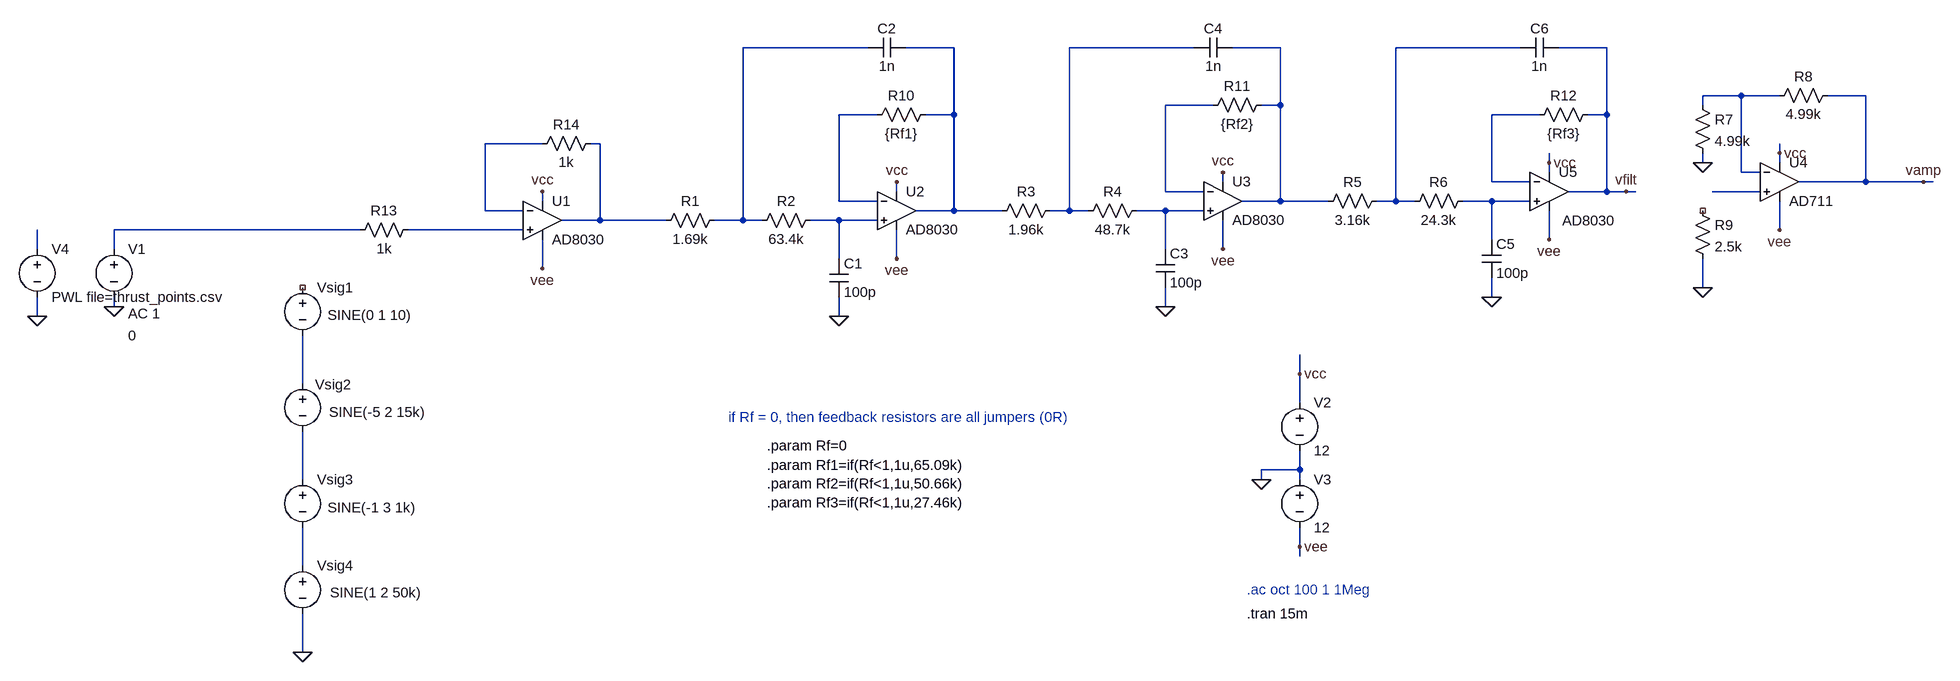
[diagram p0: schematic Anti-Aliasing Filter 30kHz 6th order Bessel - AD8030.asc]
Anti-Aliasing Filter 30kHz 6th order Bessel - AD8030.asc, the LTspice schematic file:
Version 4
SHEET 1 2352 744
WIRE 528 -304 320 -304
WIRE 672 -304 592 -304
WIRE 1072 -304 864 -304
WIRE 1216 -304 1136 -304
WIRE 1616 -304 1408 -304
WIRE 1760 -304 1680 -304
WIRE 1984 -224 1920 -224
WIRE 2048 -224 1984 -224
WIRE 2192 -224 2128 -224
WIRE 1104 -208 1024 -208
WIRE 1216 -208 1216 -304
WIRE 1216 -208 1184 -208
WIRE 1920 -208 1920 -224
WIRE 544 -192 480 -192
WIRE 672 -192 672 -304
WIRE 672 -192 624 -192
WIRE 1648 -192 1568 -192
WIRE 1760 -192 1760 -304
WIRE 1760 -192 1728 -192
WIRE -16 -144 -112 -144
WIRE 80 -144 64 -144
WIRE 2048 -128 2048 -144
WIRE 1664 -112 1664 -128
WIRE 1920 -112 1920 -128
WIRE 2048 -112 2048 -128
WIRE 1664 -96 1664 -112
WIRE 1984 -96 1984 -224
WIRE 2016 -96 1984 -96
WIRE 1120 -80 1120 -96
WIRE 1568 -80 1568 -192
WIRE 1632 -80 1568 -80
WIRE 2192 -80 2192 -224
WIRE 2192 -80 2080 -80
WIRE 2288 -80 2192 -80
WIRE 2304 -80 2288 -80
WIRE 576 -64 576 -80
WIRE 1024 -64 1024 -208
WIRE 1088 -64 1024 -64
WIRE 1760 -64 1760 -192
WIRE 1760 -64 1696 -64
WIRE 1792 -64 1760 -64
WIRE 1808 -64 1792 -64
WIRE 2016 -64 1936 -64
WIRE -16 -48 -16 -64
WIRE 480 -48 480 -192
WIRE 544 -48 480 -48
WIRE 1216 -48 1216 -208
WIRE 1216 -48 1152 -48
WIRE 1296 -48 1216 -48
WIRE 1408 -48 1408 -304
WIRE 1408 -48 1376 -48
WIRE 1440 -48 1408 -48
WIRE 1568 -48 1520 -48
WIRE 1632 -48 1568 -48
WIRE -112 -32 -112 -144
WIRE -48 -32 -112 -32
WIRE 672 -32 672 -192
WIRE 672 -32 608 -32
WIRE 752 -32 672 -32
WIRE 864 -32 864 -304
WIRE 864 -32 832 -32
WIRE 896 -32 864 -32
WIRE 1024 -32 976 -32
WIRE 1088 -32 1024 -32
WIRE 80 -16 80 -144
WIRE 80 -16 16 -16
WIRE 192 -16 80 -16
WIRE 320 -16 320 -304
WIRE 320 -16 272 -16
WIRE 352 -16 320 -16
WIRE 480 -16 432 -16
WIRE 544 -16 480 -16
WIRE -320 0 -832 0
WIRE -48 0 -240 0
WIRE 2048 0 2048 -48
WIRE 1568 16 1568 -48
WIRE 1664 16 1664 -32
WIRE -960 32 -960 0
WIRE -832 32 -832 0
WIRE 1024 32 1024 -32
WIRE 1120 32 1120 -16
WIRE 480 48 480 -16
WIRE 576 48 576 0
WIRE -16 64 -16 16
WIRE 1920 96 1920 48
WIRE 1568 112 1568 80
WIRE -832 128 -832 112
WIRE 1024 128 1024 96
WIRE -960 144 -960 112
WIRE 480 144 480 112
WIRE 1248 240 1248 208
WIRE -416 256 -416 176
WIRE 1248 288 1248 240
WIRE 1248 400 1248 368
WIRE 1248 400 1184 400
WIRE -416 416 -416 336
WIRE 1184 416 1184 400
WIRE 1248 416 1248 400
WIRE 1248 528 1248 496
WIRE 1248 544 1248 528
WIRE -416 560 -416 496
WIRE -416 704 -416 640
FLAG -832 128 0
FLAG 480 144 0
FLAG 576 -80 vcc
FLAG 576 48 vee
FLAG 1184 416 0
FLAG 1248 240 vcc
FLAG 1248 528 vee
FLAG 1024 128 0
FLAG 1120 -96 vcc
FLAG 1120 32 vee
FLAG 1568 112 0
FLAG 1664 16 vee
FLAG 1792 -64 vfilt
FLAG 2048 -128 vcc
FLAG 2048 0 vee
FLAG 1920 -112 0
FLAG 2288 -80 vamp
FLAG -416 704 0
FLAG 1920 96 0
FLAG -960 144 0
FLAG -16 -64 vcc
FLAG -16 64 vee
FLAG 1664 -112 vcc
SYMBOL voltage -832 16 R0
WINDOW 123 24 124 Left 2
WINDOW 39 0 0 Left 0
WINDOW 3 24 160 Left 2
SYMATTR Value2 AC 1
SYMATTR Value 0
SYMATTR InstName V1
SYMBOL res 288 -32 R90
WINDOW 0 0 56 VBottom 2
WINDOW 3 32 56 VTop 2
SYMATTR InstName R1
SYMATTR Value 1.69k
SYMBOL res 448 -32 R90
WINDOW 0 0 56 VBottom 2
WINDOW 3 32 56 VTop 2
SYMATTR InstName R2
SYMATTR Value 63.4k
SYMBOL cap 464 48 R0
SYMATTR InstName C1
SYMATTR Value 100p
SYMBOL cap 592 -320 R90
WINDOW 0 0 32 VBottom 2
WINDOW 3 32 32 VTop 2
SYMATTR InstName C2
SYMATTR Value 1n
SYMBOL voltage 1248 272 R0
WINDOW 123 0 0 Left 0
WINDOW 39 0 0 Left 0
SYMATTR InstName V2
SYMATTR Value 12
SYMBOL voltage 1248 400 R0
WINDOW 123 0 0 Left 0
WINDOW 39 0 0 Left 0
SYMATTR InstName V3
SYMATTR Value 12
SYMBOL res 848 -48 R90
WINDOW 0 0 56 VBottom 2
WINDOW 3 32 56 VTop 2
SYMATTR InstName R3
SYMATTR Value 1.96k
SYMBOL res 992 -48 R90
WINDOW 0 0 56 VBottom 2
WINDOW 3 32 56 VTop 2
SYMATTR InstName R4
SYMATTR Value 48.7k
SYMBOL cap 1008 32 R0
SYMATTR InstName C3
SYMATTR Value 100p
SYMBOL cap 1136 -320 R90
WINDOW 0 0 32 VBottom 2
WINDOW 3 32 32 VTop 2
SYMATTR InstName C4
SYMATTR Value 1n
SYMBOL res 1392 -64 R90
WINDOW 0 0 56 VBottom 2
WINDOW 3 32 56 VTop 2
SYMATTR InstName R5
SYMATTR Value 3.16k
SYMBOL res 1536 -64 R90
WINDOW 0 0 56 VBottom 2
WINDOW 3 32 56 VTop 2
SYMATTR InstName R6
SYMATTR Value 24.3k
SYMBOL cap 1552 16 R0
SYMATTR InstName C5
SYMATTR Value 100p
SYMBOL cap 1680 -320 R90
WINDOW 0 0 32 VBottom 2
WINDOW 3 32 32 VTop 2
SYMATTR InstName C6
SYMATTR Value 1n
SYMBOL OpAmps\\AD711 2048 -144 R0
SYMATTR InstName U4
SYMBOL res 1904 -224 R0
SYMATTR InstName R7
SYMATTR Value 4.99k
SYMBOL res 2144 -240 R90
WINDOW 0 0 56 VBottom 2
WINDOW 3 32 56 VTop 2
SYMATTR InstName R8
SYMATTR Value 4.99k
SYMBOL voltage -416 80 R0
WINDOW 3 42 62 Left 2
WINDOW 123 24 124 Left 2
WINDOW 39 0 0 Left 0
SYMATTR Value SINE(0 1 10)
SYMATTR InstName Vsig1
SYMBOL voltage -416 240 R0
WINDOW 3 44 64 Left 2
WINDOW 123 24 124 Left 2
WINDOW 39 0 0 Left 0
WINDOW 0 21 18 Left 2
SYMATTR Value SINE(-5 2 15k)
SYMATTR InstName Vsig2
SYMBOL voltage -416 400 R0
WINDOW 3 42 63 Left 2
WINDOW 123 24 124 Left 2
WINDOW 39 0 0 Left 0
SYMATTR Value SINE(-1 3 1k)
SYMATTR InstName Vsig3
SYMBOL voltage -416 544 R0
WINDOW 3 46 61 Left 2
WINDOW 123 24 124 Left 2
WINDOW 39 0 0 Left 0
SYMATTR Value SINE(1 2 50k)
SYMATTR InstName Vsig4
SYMBOL res 1904 -48 R0
SYMATTR InstName R9
SYMATTR Value 2.5k
SYMBOL voltage -960 16 R0
WINDOW 123 0 0 Left 0
WINDOW 39 0 0 Left 0
SYMATTR InstName V4
SYMATTR Value PWL file=thrust_points.csv
SYMBOL OpAmps\\AD8030 -16 -80 R0
SYMATTR InstName U1
SYMBOL OpAmps\\AD8030 576 -96 R0
SYMATTR InstName U2
SYMBOL OpAmps\\AD8030 1120 -112 R0
SYMATTR InstName U3
SYMBOL OpAmps\\AD8030 1664 -128 R0
WINDOW 3 22 113 Left 2
SYMATTR InstName U5
SYMBOL res 640 -208 R90
WINDOW 0 0 56 VBottom 2
WINDOW 3 32 56 VTop 2
SYMATTR InstName R10
SYMATTR Value {Rf1}
SYMBOL res 1200 -224 R90
WINDOW 0 0 56 VBottom 2
WINDOW 3 32 56 VTop 2
SYMATTR InstName R11
SYMATTR Value {Rf2}
SYMBOL res 1744 -208 R90
WINDOW 0 0 56 VBottom 2
WINDOW 3 32 56 VTop 2
SYMATTR InstName R12
SYMATTR Value {Rf3}
SYMBOL res -224 -16 R90
WINDOW 0 0 56 VBottom 2
WINDOW 3 32 56 VTop 2
SYMATTR InstName R13
SYMATTR Value 1k
SYMBOL res 80 -160 R90
WINDOW 0 0 56 VBottom 2
WINDOW 3 32 56 VTop 2
SYMATTR InstName R14
SYMATTR Value 1k
TEXT 1160 600 Left 2 ;.ac oct 100 1 1Meg
TEXT 1160 640 Left 2 !.tran 15m
TEXT 360 392 Left 2 !.param Rf1=if(Rf<1,1u,65.09k)\n.param Rf2=if(Rf<1,1u,50.66k)\n.param Rf3=if(Rf<1,1u,27.46k)
TEXT 360 360 Left 2 !.param Rf=0
TEXT 296 312 Left 2 ;if Rf = 0, then feedback resistors are all jumpers (0R)

The netlist it stands for:
* Anti-Aliasing Filter 30kHz 6th order Bessel - AD8030.asc
V1 N016 0 0 AC 1
R1 N001 N011 1.69k
R2 N015 N001 63.4k
C1 N015 0 100p
C2 N002 N001 1n
V2 vcc 0 12
V3 0 vee 12
R3 N003 N002 1.96k
R4 N014 N003 48.7k
C3 N014 0 100p
C4 N004 N003 1n
R5 N005 N004 3.16k
R6 N013 N005 24.3k
C5 N013 0 100p
C6 vfilt N005 1n
XU4 N012 N006 vcc vee vamp AD712  ; AD711, pins In+ In- V+ V- OUT
R7 N006 0 4.99k
R8 vamp N006 4.99k
Vsig1 NC_01 N019 SINE(0 1 10)
Vsig2 N019 N020 SINE(-5 2 15k)
Vsig3 N020 N021 SINE(-1 3 1k)
Vsig4 N021 0 SINE(1 2 50k)
R9 NC_02 0 2.5k
V4 N018 0 PWL file=thrust_points.csv
XU1 N017 N010 vcc vee N011 AD8040  ; AD8030, pins In+ In- V+ V- OUT
XU2 N015 N008 vcc vee N002 AD8040  ; AD8030, pins In+ In- V+ V- OUT
XU3 N014 N007 vcc vee N004 AD8040  ; AD8030, pins In+ In- V+ V- OUT
XU5 N013 N009 vcc vee vfilt AD8040  ; AD8030, pins In+ In- V+ V- OUT
R10 N002 N008 {Rf1}
R11 N004 N007 {Rf2}
R12 vfilt N009 {Rf3}
R13 N017 N016 1k
R14 N011 N010 1k
* .ac oct 100 1 1Meg
.tran 15m
.param Rf1=if(Rf<1,1u,65.09k)
.param Rf2=if(Rf<1,1u,50.66k)
.param Rf3=if(Rf<1,1u,27.46k)
.param Rf=0
* if Rf = 0, then feedback resistors are all jumpers (0R)
.lib ADI1.lib
.lib ADI.lib
.backanno
.end